# Altium schematic sheet Test.SchDoc
size A; SheetNumber: 1; SheetTotal: 1
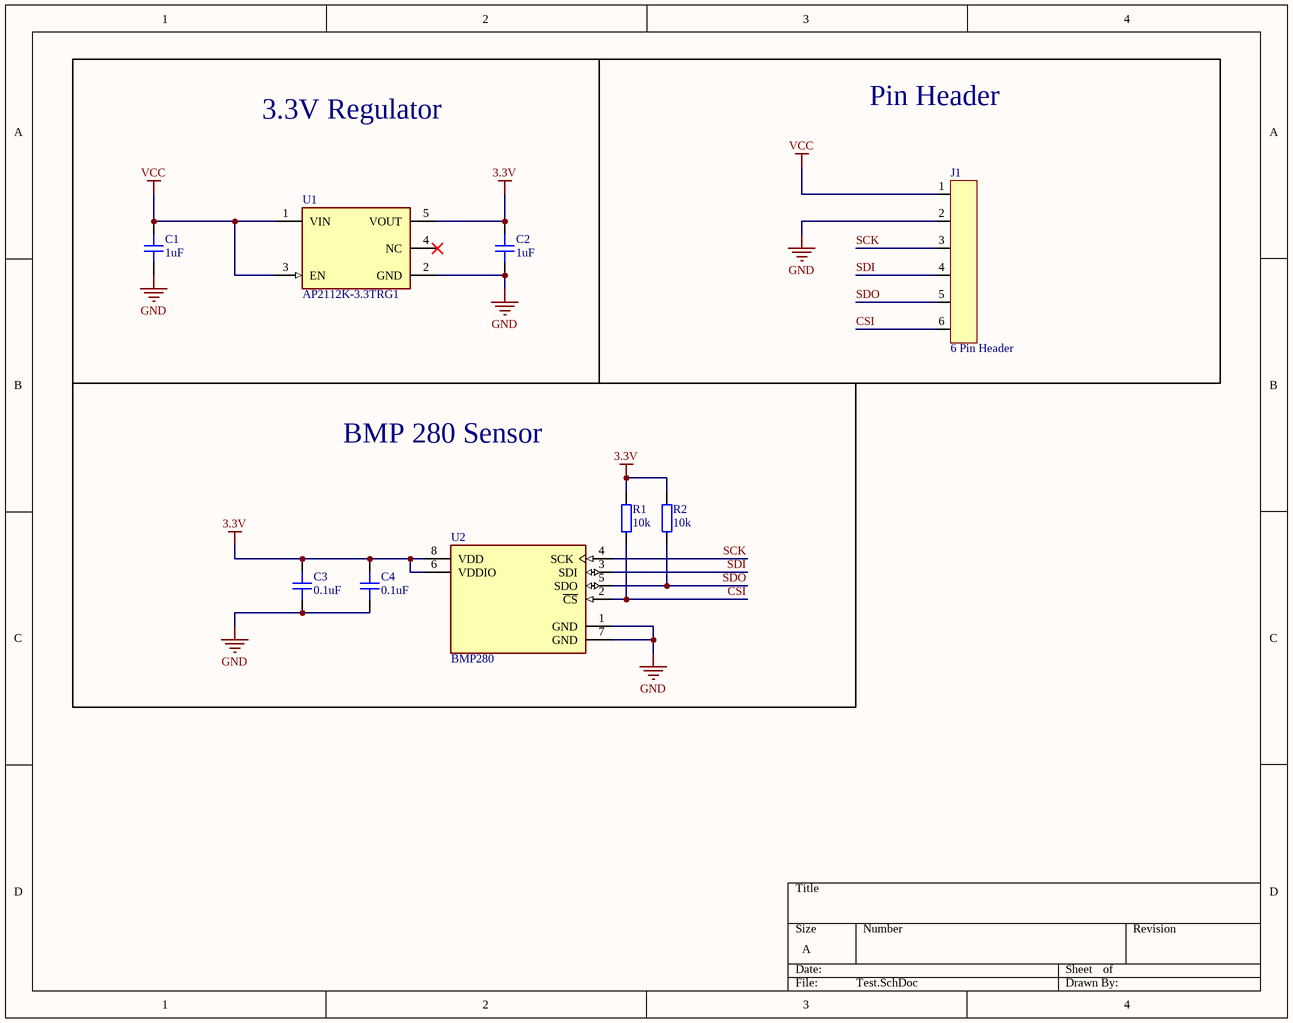
[diagram p0: Test.SchDoc]

## Parts
C1  1uF  [CAP_0805]
C2  1uF  [CAP_0805]
C3  0.1uF  [CAP_0603]
C4  0.1uF  [CAP_0603]
J1  6 Pin Header  [G800W302018EU]
R1  10k  [RES_0603]
R2  10k  [RES_0603]
U1  AP2112K-3.3TRG1  [FP-SOT25-IPC_A]
U2  BMP280  [FP-BMP280-MFG]

## Blocks framed on the sheet
BMP 280 Sensor: C3 C4 R1 R2 U2

## Nets
3.3V: C2.2 C3.2 C4.2 R1.2 R2.2 U1.5(VOUT) U2.6(VDDIO) U2.8(VDD)
GND: C1.1 C2.1 C3.1 C4.1 J1.2 U1.2(GND) U2.1(GND) U2.7(GND)
VCC: C1.2 J1.1 U1.1(VIN) U1.3(EN)
CSI: J1.6 R1.1 U2.2(~{CS})
SCK: J1.3 U2.4(SCK)
SDI: J1.4 U2.3(SDI)
SDO: J1.5 R2.1 U2.5(SDO)

Not connected (* = marked no-connect by the designer): U1 4(NC)*

## Notes on the sheet
- 3.3V Regulator
- Pin Header

## Library data of the parts
C1 C2 = CAP_0805: Capacitor SMD 0805; Manufacturer: *; Manufacturer Part Number: *; Distributor Link: *; LCSC: *; Rating: *; Dielectric: *
C3 C4 = CAP_0603: Capacitor SMD 0603; Manufacturer: *; Manufacturer Part Number: *; Distributor Link: *; LCSC: *; Rating: *; Dielectric: *
J1 = G800W302018EU: Pin Header 6 Position 2.54mm Pitch; Manufacturer: Amphenol; Manufacturer Part Number: G800W302018EU
R1 R2 = RES_0603: Resistor SMD 0603; Manufacturer: *; Manufacturer Part Number: *; Distributor Link: *; LCSC: *
U1 = CMP-12756-000035-1: IC REG LINEAR 3.3V 600MA SOT25; Number of Regulators: 1; Output Type: Fixed; Polarity: Positive; Min Input Voltage: 2.5V; Max Input Voltage: 6V; Accuracy: 1.5%; Quiescent Current: 55uA; Dropout Voltage: 250mV; Min Operating Temperature: -40°C; Length: 3.1mm; Output Current: 600mA; Max Operating Temperature: 85°C; Package Quantity: 1; Output Voltage: 3.3V; Width: 1.7mm; Number of Outputs: 1; Packaging: Tape and Reel; Height: 1.3mm; Lead Free: Lead Free; Max Output Current: 600mA; Case/Package: SOT-23-5; Mount: Surface Mount; Number of Pins: 5
U2 = CMP-2000-05076-3: SENSOR PRESSURE ABS; Operating Pressure: 15.95PSI; Pressure Type: Absolute; Output Type: SPI; Max Pressure: 290.08PSI; Port Style: No Port; Case/Package: SMD/SMT; Lead Free: Lead Free; Termination: SMD/SMT; Min Operating Temperature: -40°C; Number of Pins: 8; Max Operating Temperature: 85°C